# EAGLE design Mono_Audio_Amplifier_Scheffknecht_Melcher (EAGLE 9.6.2)
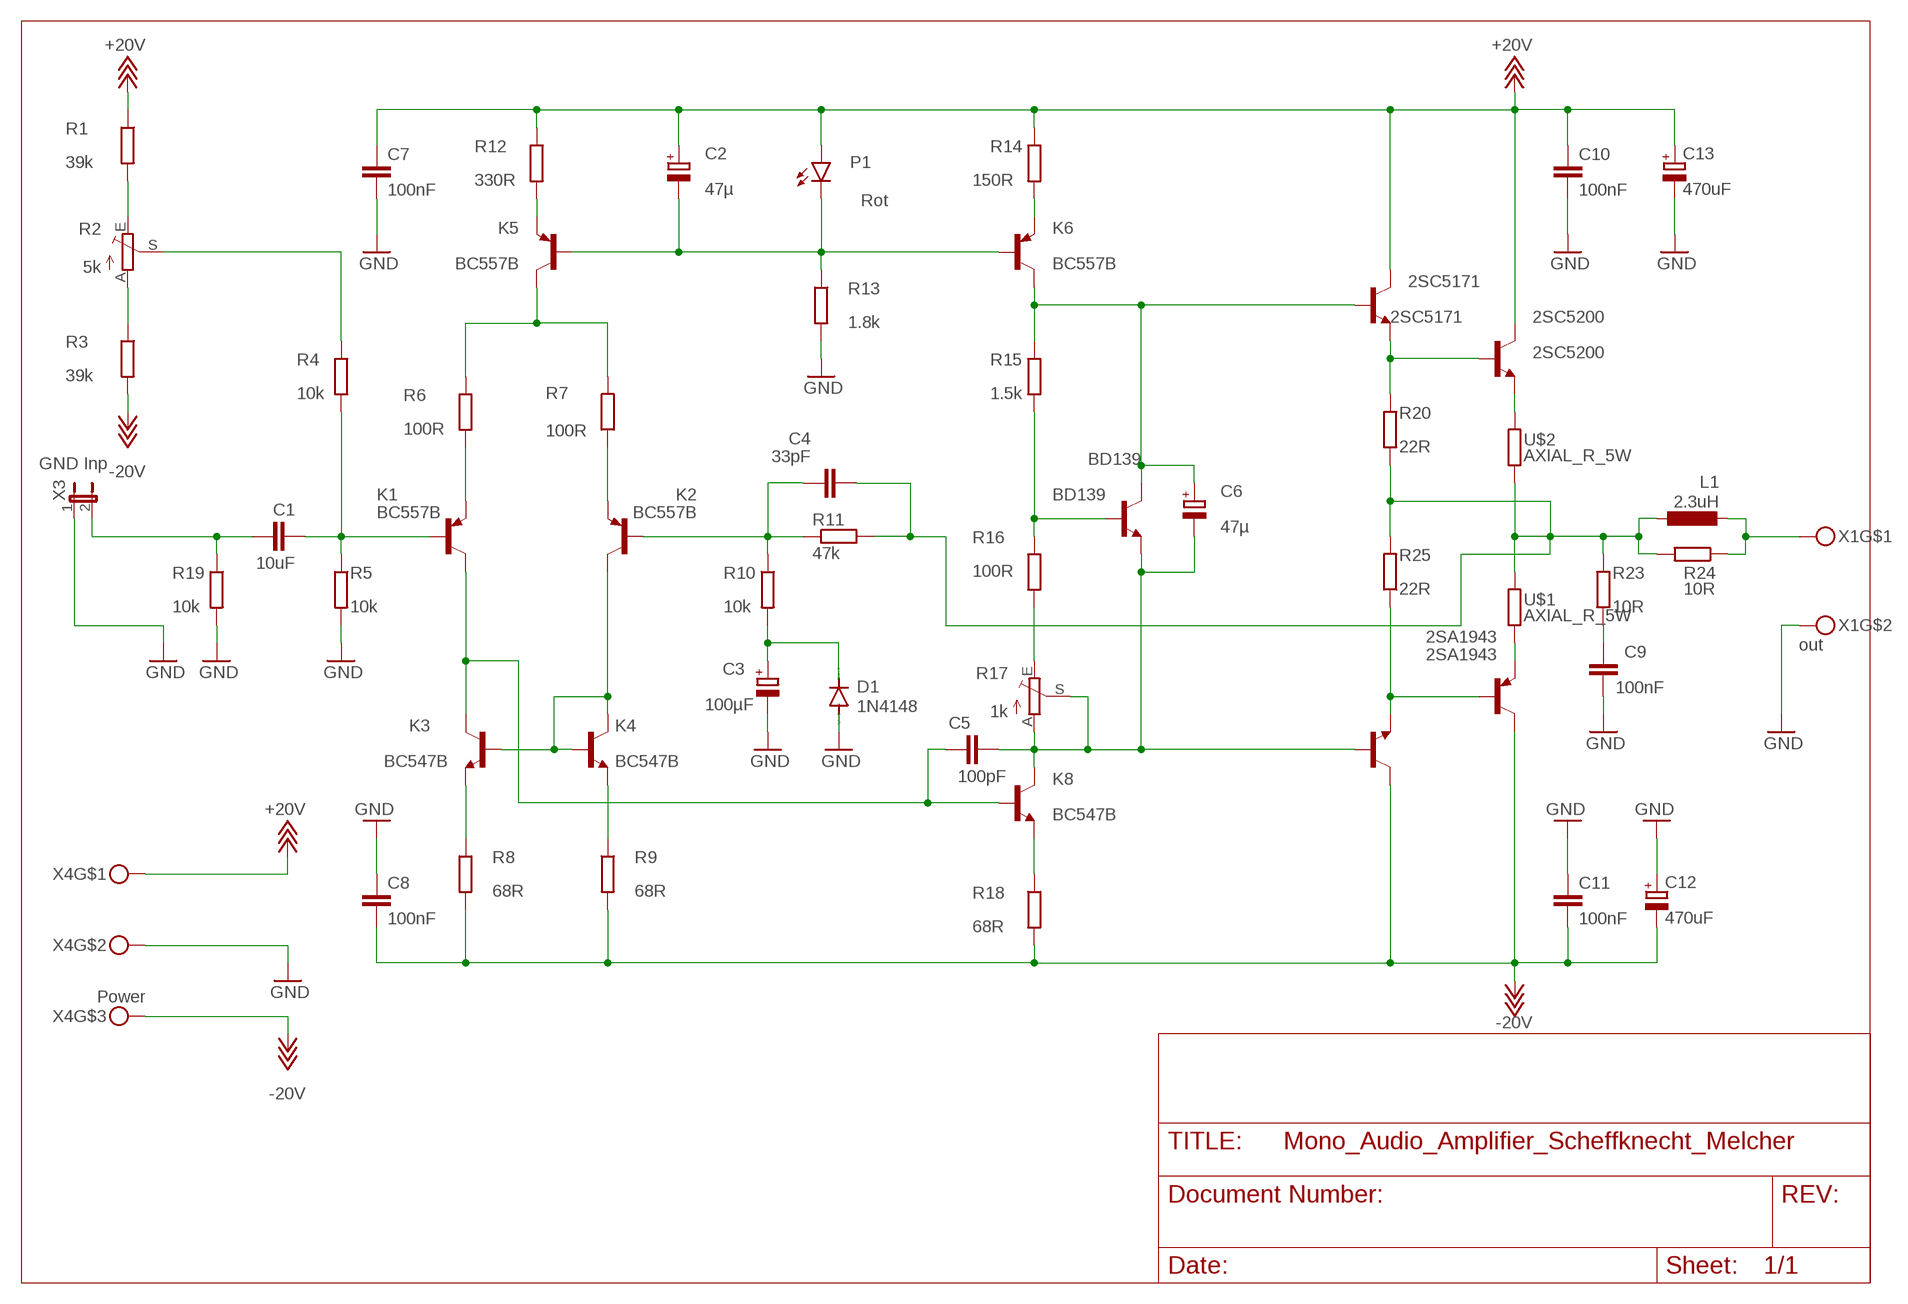
[diagram p0: schematic, sheet 1]

## Parts
2SA1930  2SA1930  2SC1306  [TO220BV]
2SA1943  2SA1943  PNP_TO264  [TO264]
2SC5171  2SC5171  2SC1306  [TO220BV]
2SC5200  2SC5200  NPN_TO264  [TO264]
BD139  BD139  -NPN-TO126V  [TO126V]
C1  10uF  C-EUC0805  [C0805]
C2  47µ  CPOL-EUE2.5-6  [E2,5-6]
C3  100µF  CPOL-EUE2.5-7  [E2,5-7]
C4  33pF  C-EUC0805  [C0805]
C5  100pF  C-EUC0805  [C0805]
C6  47µ  CPOL-EUE2.5-6  [E2,5-6]
C7  100nF  C-EUC0805  [C0805]
C8  100nF  C-EUC0805  [C0805]
C9  100nF  C-EUC0805  [C0805]
C10  100nF  C-EUC0805  [C0805]
C11  100nF  C-EUC0805  [C0805]
C12  470uF  CPOL-EUE3.5-8  [E3,5-8]
C13  470uF  CPOL-EUE3.5-8  [E3,5-8]
D1  1N4148  1N4148DO35-7  [DO35-7]
K1  BC557B  [TO92-EBC]
K2  BC557B  [TO92-EBC]
K3  BC547B  BC547-NPN-TO92-CBE  [TO92-CBE]
K4  BC547B  BC547-NPN-TO92-CBE  [TO92-CBE]
K5  BC557B  [TO92-EBC]
K6  BC557B  [TO92-EBC]
K8  BC547B  BC547-NPN-TO92-CBE  [TO92-CBE]
L1  2.3uH  L-EUTJ3-U2  [TJ3-U2]
P1  Rot  LED5MM  [LED5MM]
R1  39k  R-EU_R0805  [R0805]
R2  5k  TRIM_EU-S64W  [S64W]
R3  39k  R-EU_R0805  [R0805]
R4  10k  R-EU_R0805  [R0805]
R5  10k  R-EU_R0805  [R0805]
R6  100R  R-EU_R0805  [R0805]
R7  100R  R-EU_R0805  [R0805]
R8  68R  R-EU_R0805  [R0805]
R9  68R  R-EU_R0805  [R0805]
R10  10k  R-EU_R0805  [R0805]
R11  47k  R-EU_R0805  [R0805]
R12  330R  R-EU_R0805  [R0805]
R13  1.8k  R-EU_R0805  [R0805]
R14  150R  R-EU_R0805  [R0805]
R15  1.5k  R-EU_R0805  [R0805]
R16  100R  R-EU_R0805  [R0805]
R17  1k  TRIM_EU-S64W  [S64W]
R18  68R  R-EU_R0805  [R0805]
R19  10k  R-EU_R0805  [R0805]
R20  22R  R-EU_R0805  [R0805]
R23  10R  R-EU_R0805  [R0805]
R24  10R  R-EU_R0805  [R0805]
R25  22R  R-EU_R0805  [R0805]
U$1  AXIAL_R_5W  [AXIAL_RESISTOR]
U$2  AXIAL_R_5W  [AXIAL_RESISTOR]
X1  out  MKDS3/2_5,08  [MKDS3/2_5,08]
X3  GND Inp  JMP2  [JMP2]
X4  Power  MKDS3/3_5,08  [MKDS3/3_5,08]

## Nets
+18V: 2SC5171.2(C) 2SC5200.2(C) C2.+ C7.1 C10.1 C13.+ P1.A R1.1 R12.1 R14.1 X4.P$1 ; supply symbol labelled +20V
-18V: 2SA1930.2(C) 2SA1943.2(C) C8.2 C11.2 C12.- R3.2 R8.2 R9.2 R18.2 X4.P$3 ; supply symbol labelled -20V
AUX_IN: C1.2 K1.B R4.2 R5.1
GND: C3.- C7.2 C8.1 C9.1 C10.2 C11.1 C12.+ C13.- D1.A R5.2 R13.2 R19.2 X1.P$2 X3.1 X4.P$2
N$1: 2SC5200.3(E) U$2.P$2
N$2: 2SC5171.3(E) 2SC5200.1(B) R20.2
N$3: 2SA1943.3(E) U$1.P$1
N$5: C4.2 L1.1 R11.2 R20.1 R23.2 R24.2 R25.2 U$1.P$2 U$2.P$1
N$7: C5.1 K1.C K3.C K8.B
N$8: R16.2 R17.E
N$9: BD139.3(B) R15.2 R16.1
N$10: 2SA1930.1(B) BD139.1(E) C5.2 C6.- K8.C R17.A R17.S
N$11: 2SC5171.1(B) BD139.2(C) C6.+ K6.C R15.1
N$13: K8.E R18.1
N$14: K6.E R14.2
N$15: K5.C R6.1 R7.1
N$16: K5.E R12.2
N$17: C4.1 K2.B R10.1 R11.1
N$18: K4.E R9.1
N$19: C2.- K5.B K6.B P1.K(C) R13.1
N$20: K1.E R6.2
N$21: K3.E R8.1
N$22: K2.E R7.2
N$23: K2.C K3.B K4.B K4.C
N$24: C3.+ D1.C R10.2
N$25: C9.2 R23.1
N$26: C1.1 R19.1 X3.2
N$27: R1.2 R2.E
N$28: 2SA1930.3(E) 2SA1943.1(B) R25.1
N$29: R2.S R4.1
N$30: R2.A R3.1
N$31: L1.2 R24.1 X1.P$1

## Library data of the parts
2SA1930 2SC5171 = transistor:2SC1306: NPN Transistor Final RF Power Outupt Source: 2sc1306.pdf
2SA1943 = 0_Custom-Lib_Verstärker:PNP_TO264
2SC5200 = 0_Custom-Lib_Verstärker:NPN_TO264
BD139 K3 K4 K8 = transistor:*-NPN-: NPN Transistror BF959 corrected 2008.03.06
C1 C4 C5 C7-C11 = rcl:C-EU: CAPACITOR, European symbol; SPICEPREFIX: C
C2 C3 C6 C12 C13 = rcl:CPOL-EU: POLARIZED CAPACITOR, European symbol; SPICEPREFIX: C
D1 = diode:1N4148: DIODE high speed (Philips)
K1 K2 K5 K6 = transistor-pnp:BC557*: PNP Transistror
L1 = rcl:L-EU: INDUCTOR, European symbol; SPICEPREFIX: L
P1 = led:LED: LED OSRAM: - CHIPLED LG R971, LG N971, LY N971, LG Q971, LY Q971, LO R971, LY R971 LH N974, LH R974 LS Q976, LO Q976, LY Q976 LO Q996 - Hyper CHIPLED LW Q18S LB Q993, LB Q99A, LB R99A - SideLED LS A670, LO A670, LY A670, LG A670, LP A670 LB A673, LV A673, LT A673, LW A673 LH A674 LY A675 LS A676, LA A676, LO A676, LY A676, LW A676 LS A679, LY A679, LG A679 - Hyper Micro SIDELED® LS Y876, LA Y876, LO Y876, LY Y876 LT Y87S - SmartLED LW L88C, LW L88S LB L89C, LB L89S, LG L890 LS L89K, LO L89K, LY L89K LS L896, LA L896, LO L896, LY L896 - TOPLED LS T670, LO T670, LY T670, LG T670, LP T670 LSG T670, LSP T670, LSY T670, LOP T670, LYG T670 LG T671, LOG T671, LSG T671 LB T673, LV T673, LT T673, LW T673 LH T674 LS T676, LA T676, LO T676, LY T676, LB T676, LH T676, LSB T676, LW T676 LB T67C, LV T67C, LT T67C, LS T67K, LO T67K, LY T67K, LW E67C LS E67B, LA E67B, LO E67B, LY E67B, LB E67C, LV E67C, LT E67C LW T67C LS T679, LY T679, LG T679 LS T770, LO T770, LY T770, LG T770, LP T770 LB T773, LV T773, LT T773, LW T773 LH T774 LS E675, LA E675, LY E675, LS T675 LS T776, LA T776, LO T776, LY T776, LB T776 LHGB T686 LT T68C, LB T68C - Hyper Mini TOPLED® LB M676 - Mini TOPLED Santana® LG M470 LS M47K, LO M47K, LY M47K Source: http://www.osram.convergy.de LUXEON: - LUMILED® LXK2-PW12-R00, LXK2-PW12-S00, LXK2-PW14-U00, LXK2-PW14-V00 LXK2-PM12-R00, LXK2-PM12-S00, LXK2-PM14-U00 LXK2-PE12-Q00, LXK2-PE12-R00, LXK2-PE12-S00, LXK2-PE14-T00, LXK2-PE14-U00 LXK2-PB12-K00, LXK2-PB12-L00, LXK2-PB12-M00, LXK2-PB14-N00, LXK2-PB14-P00, LXK2-PB14-Q00 LXK2-PR12-L00, LXK2-PR12-M00, LXK2-PR14-Q00, LXK2-PR14-R00 LXK2-PD12-Q00, LXK2-PD12-R00, LXK2-PD12-S00 LXK2-PH12-R00, LXK2-PH12-S00 LXK2-PL12-P00, LXK2-PL12-Q00, LXK2-PL12-R00 Source: www.luxeon.com KINGBRIGHT: KA-3528ASYC Source: www.kingbright.com
R1 R3-R16 R18-R20 R23-R25 = rcl:R-EU_: RESISTOR, European symbol; SPICEPREFIX: R
R2 R17 = pot:TRIM_EU-: POTENTIOMETER
U$1 U$2 = 0_Custom-Lib_Verstärker:AXIAL_R_5W
X1 = 0_HTL_elektro:MKDS3/2_5,08: Leiterplattenklemme 2-polig
X3 = 0_HTL_elektro:JMP2: Jumper 2-polig
X4 = 0_HTL_elektro:MKDS3/3_5,08: Leiterplattenklemme 3-polig

## Module TEST
Ports: 

### Library data of the parts

## Board
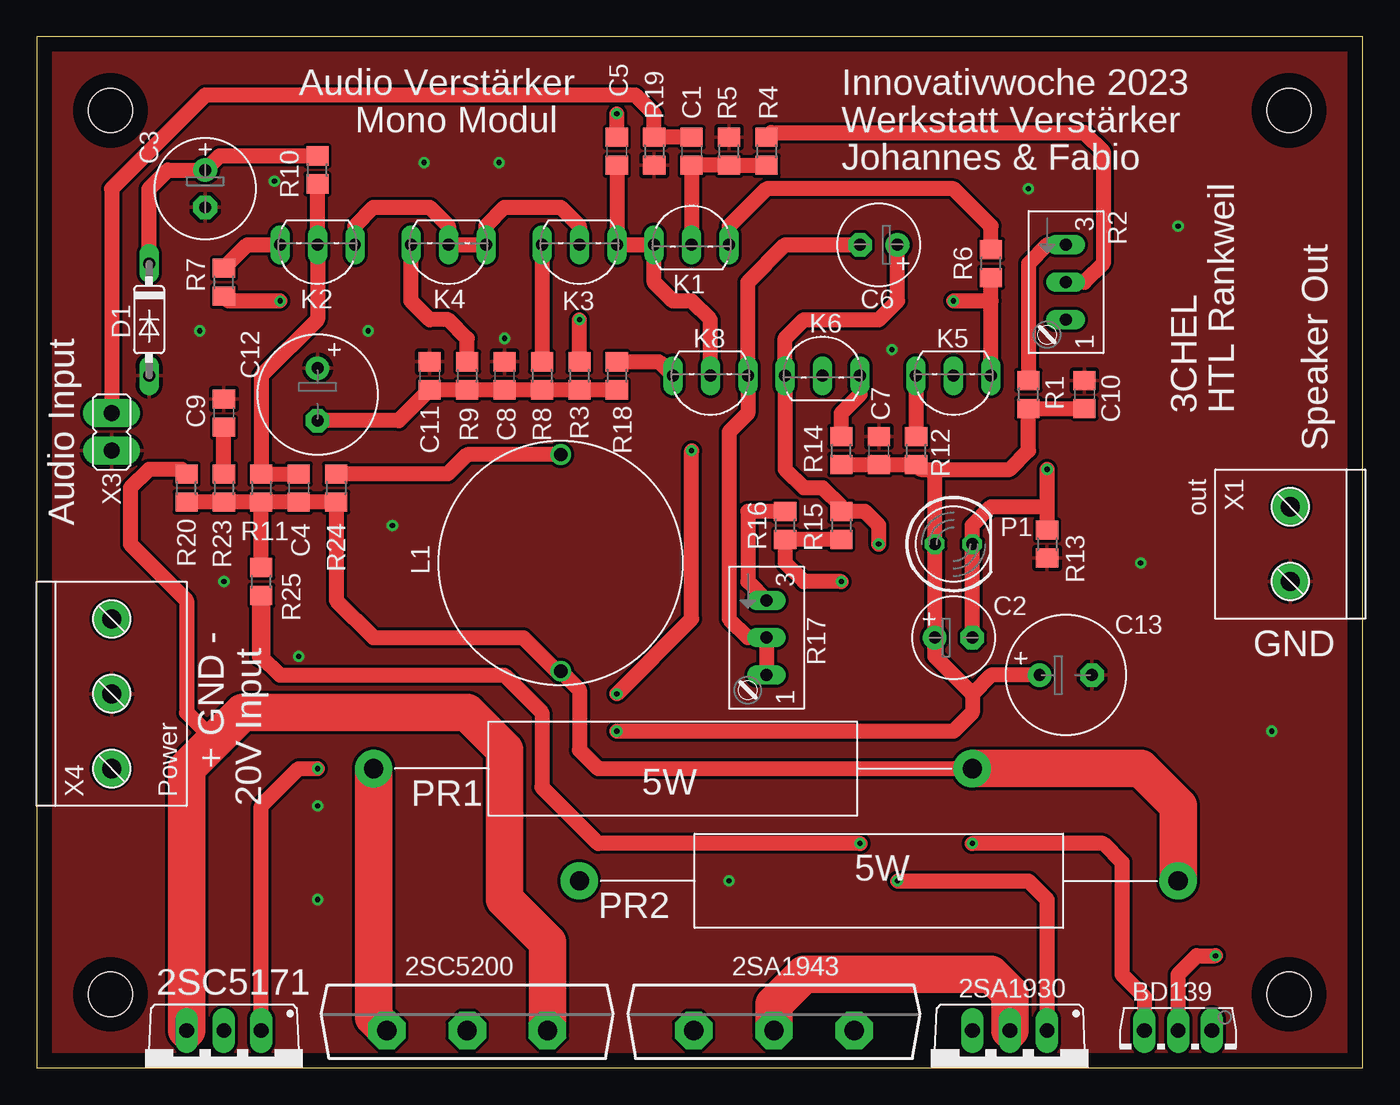
[diagram p1: board, top side]
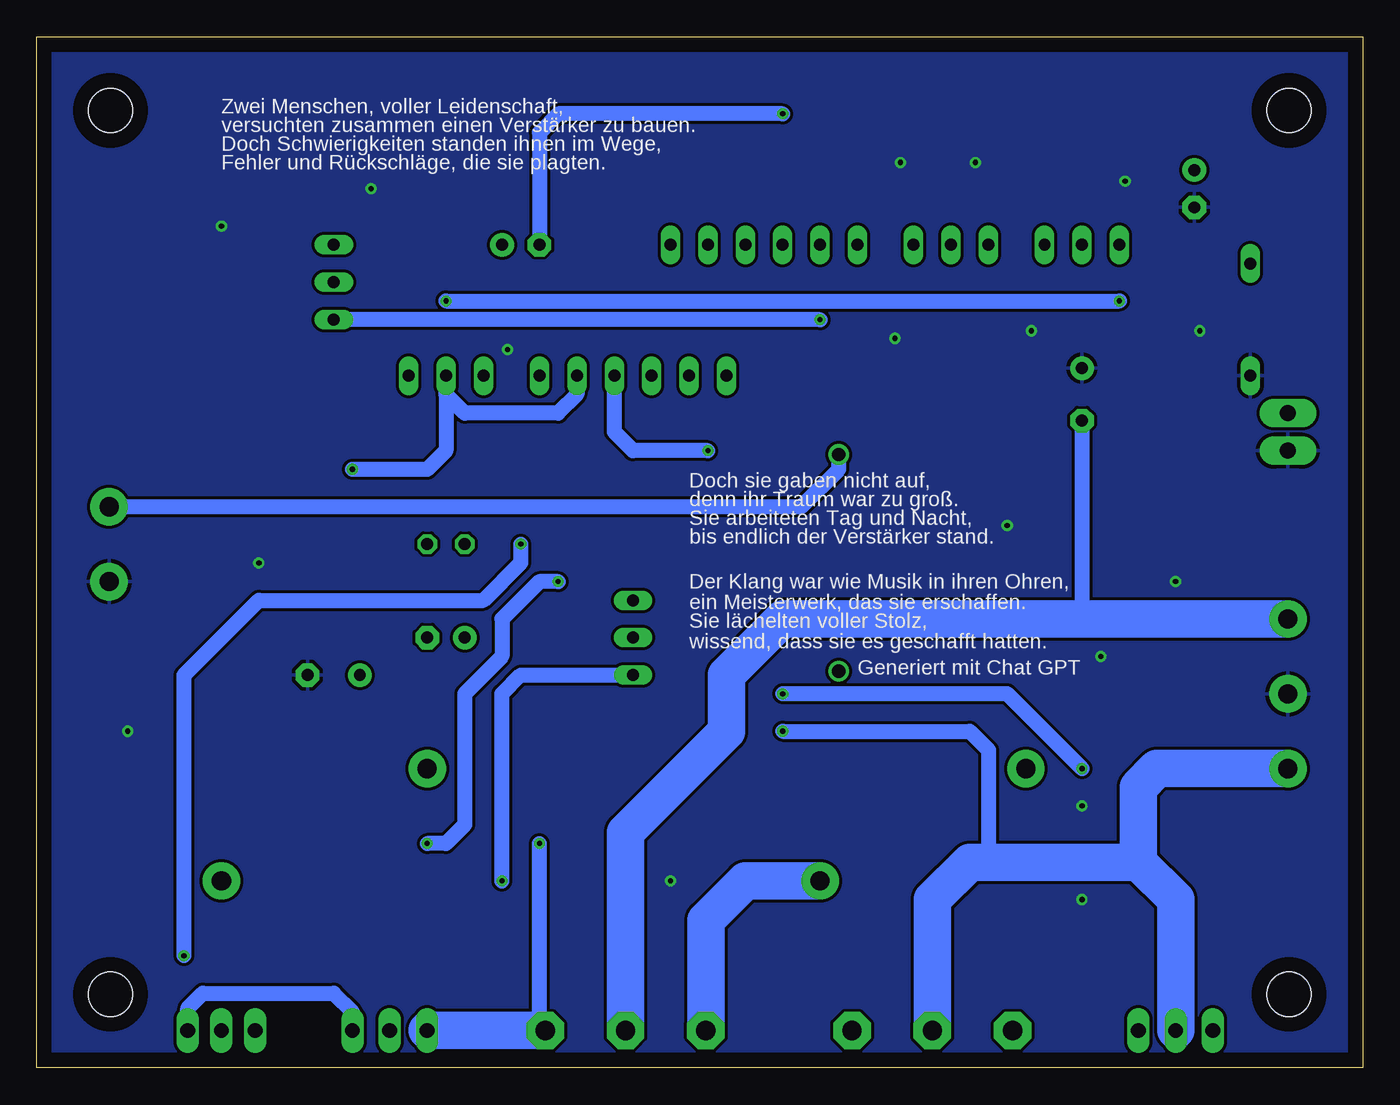
[diagram p2: board, bottom side, seen from below]

Size 90 x 70 mm. Coordinates in mm from the lower left corner, seen from the top.
Outline: 0,0 90,0 90,70 0,70 0,0
Copper layers (1*16): Top 0.035mm / dielectric 1.5mm / Bottom 0.035mm
Design rules "default *": minimum track width 16mil, minimum drill 0.35mm, track to track 8mil, track to pad 8mil, pad to pad 8mil, via to via 8mil, smd to smd 8mil, copper to edge 40mil, drill to drill 8mil, minimum pad ring 10mil, minimum via ring 8mil, stop-mask expansion 4mil, vias tented up to drill 0mil, thermal gap 10mil
Holes 3 mm at 5,65 85,65 85,5 5,5

### Footprints (pad centres in the part's own frame; a part is rotated, then mirrored left to right if it is on the bottom)
TO220BV = drill 1.016 long: 1 -2.54,-2.54; 2 0,-2.54; 3 2.54,-2.54
TO264 = drill 1.3 pad 2.54 octagon: 1 -5.45,0; 2 0,0; 3 5.45,0
TO126V = drill 1.016 long: 1 -2.286,-1.27; 2 0,-1.27; 3 2.286,-1.27
C0805 = smd 1.3 x 1.5: 1 -0.95,0; 2 0.95,0
E2,5-6 = drill 0.813 pad 1.6: + -1.27,0 | drill 0.813 pad 1.6 octagon: - 1.27,0
E2,5-7 = drill 0.813 pad 1.6: + -1.27,0 | drill 0.813 pad 1.6 octagon: - 1.27,0
E3,5-8 = drill 0.813 pad 1.6: + -1.778,0 | drill 0.813 pad 1.6 octagon: - 1.778,0
DO35-7 = drill 0.813 long: A 3.81,0; C -3.81,0
TO92-EBC = drill 0.813 long: B 0,-1.27; C -2.54,-1.27; E 2.54,-1.27
TO92-CBE = drill 0.813 long: B 0,0; C -2.54,0; E 2.54,0
TJ3-U2 = drill 0.9: 1 -7.35,0; 2 7.35,0
LED5MM = drill 0.813 octagon: A -1.27,0; K 1.27,0
R0805 = smd 1.3 x 1.5: 1 -0.95,0; 2 0.95,0
S64W = drill 0.813 long: A 2.54,1.27; E -2.54,1.27; S 0,1.27
AXIAL_RESISTOR = drill 1.3 pad 2.54: P$1 -20.32,0; P$2 20.32,0
MKDS3/2_5,08 = drill 1.3 pad 2.54: P$1 -2.54,0; P$2 2.54,0
JMP2 = drill 1.1 pad 1.93 long: 1 0,-1.27; 2 0,1.27
MKDS3/3_5,08 = drill 1.3 pad 2.54: P$1 -5.08,0; P$2 0,0; P$3 5.08,0

### Placement (x,y rotation side)
2SA1930  66.04,0 180 top
2SA1943  50.04,2.54 180 top
2SC5171  12.7,0 180 top
2SC5200  29.21,2.54 180 top
BD139  77.47,1.27 180 top
C1  44.45,62.23 270 top
C2  62.23,29.21 0 top
C3  11.43,59.69 270 top
C4  17.78,39.37 270 top
C5  39.37,62.23 90 top
C6  57.15,55.88 180 top
C7  57.15,41.91 90 top
C8  31.75,46.99 270 top
C9  12.7,44.45 270 top
C10  71.12,45.72 90 top
C11  26.67,46.99 270 top
C12  19.05,45.72 270 top
C13  69.85,26.67 0 top
D1  7.62,50.8 270 top
K1  44.45,57.15 0 top
K2  19.05,54.61 180 top
K3  36.83,55.88 180 top
K4  27.94,55.88 180 top
K5  62.23,45.72 180 top
K6  53.34,48.26 0 top
K8  45.72,46.99 180 top
L1  35.56,34.29 90 top
P1  62.23,35.56 0 top
R1  67.31,45.72 90 top
R2  68.58,53.34 270 top
R3  36.83,46.99 270 top
R4  49.53,62.23 270 top
R5  46.99,62.23 90 top
R6  64.77,54.61 90 top
R7  12.7,53.34 90 top
R8  34.29,46.99 270 top
R9  29.21,46.99 270 top
R10  19.05,60.96 90 top
R11  15.24,39.37 270 top
R12  59.69,41.91 90 top
R13  68.58,35.56 270 top
R14  54.61,41.91 90 top
R15  54.61,36.83 270 top
R16  50.8,36.83 90 top
R17  48.26,29.21 270 top
R18  39.37,46.99 270 top
R19  41.91,62.23 270 top
R20  10.16,39.37 90 top
R23  12.7,39.37 270 top
R24  20.32,39.37 270 top
R25  15.24,33.02 90 top
U$1  57.15,12.7 0 top
U$2  43.18,20.32 180 top
X1  85.09,35.56 270 top
X3  5.08,43.18 0 top
X4  5.08,25.4 90 top

### Tracks (layer width: path | path; a pad name or v marks a point on that pad's centre or on a via)
+18V  (via drill 0.35)
  Top 1.016: C10.1 R1.1 67.31,41.91 66.04,40.64 60.96,40.64 | 63.5,25.4 63.5,24.13 62.23,22.86 v39.37,22.86 | 63.5,25.4 60.96,27.94 C2.+ P1.A 60.96,40.64 | 63.5,25.4 64.77,26.67 C13.+ | 60.96,40.64 60.01,40.64 R12.1 C7.1 R14.1
  Bottom 1.016: v39.37,22.86 26.67,22.86 25.4,21.59 25.4,13.97
  Bottom 2.54: 15.24,13.97 25.4,13.97 26.67,13.97 29.21,11.43 2SC5200.2 | X4.P$1 13.97,20.32 15.24,19.05 15.24,13.97 | 15.24,13.97 12.7,11.43 2SC5171.2
-18V
  Top 1.016: C12.- 24.57,43.94 C11.2 R9.2 C8.2 R8.2 R3.2 R18.2
  Top 2.54: 2SA1930.2 66.04,5.08 64.77,6.35 52.07,6.35 50.04,4.32 2SA1943.2
  Bottom 1.016: C12.- 19.05,30.48
  Bottom 2.54: X4.P$3 19.05,30.48 39.37,30.48 43.18,26.67 43.18,22.86 50.04,16 2SA1943.2
AUX_IN
  Top 1.016: K1.B C1.2 R5.1 R4.2
GND  (via drill 0.35)
  other vias: 31.75,49.53 24.13,36.83 31.37,61.47 77.47,57.15 83.82,22.86 19.05,17.78 19.05,11.43 11.05,50.04 22.48,50.04 58.04,48.77 16.13,60.2 26.29,61.47 67.31,59.69 74.93,34.29 46.99,12.7 17.78,27.94 12.7,33.02
  pour Top: 0,0 0,70 90,70 90,0
  pour Bottom: 0,0 0,70 90,70 90,0
N$1
  Top 2.54: U$2.P$2 22.86,3.44 2SC5200.3
N$2
  Top 1.016: R20.2 9.84,40.64 7.62,40.64 6.35,39.37 6.35,35.56 10.16,31.75 10.16,24.13 12.06,22.23
  Top 2.54: 2SC5171.3 10.16,20.32 12.06,22.23 13.97,24.13 29.21,24.13 31.75,21.59 31.75,11.43 34.66,8.52 2SC5200.1
N$3
  Bottom 2.54: U$1.P$1 41.91,12.7 44.59,10.02 2SA1943.3
N$5
  Top 1.016: R25.2 R11.2 | R11.2 C4.2 R24.2 20.32,31.75 22.86,29.21 33.02,29.21 35.29,26.94 L1.1 36.83,25.67 36.83,21.59 38.1,20.32 U$2.P$1 | R11.2 R23.2 R20.1
  Top 2.54: U$2.P$1 74.93,20.32 77.47,17.78 U$1.P$2
N$7
  Top 1.016: K8.B 45.72,50.8 44.45,52.07 43.18,52.07 41.91,53.34 K1.C K3.C C5.1
N$8
  Top 1.016: R16.2 48.26,37.78 48.26,33.02 R17.E
N$9  (via drill 0.35)
  Top 1.016: v54.61,33.02 52.07,33.02 50.8,34.29 R16.1 R15.2 | v63.5,15.24 72.39,15.24 73.66,13.97 73.66,6.35 75.18,4.83 BD139.3
  Bottom 1.016: v54.61,33.02 55.88,33.02 58.42,30.48 58.42,27.94 60.96,25.4 60.96,16.51 62.23,15.24 v63.5,15.24
N$10  (via drill 0.35)
  Top 1.016: R17.A R17.S 48.26,29.21 46.99,30.48 46.99,43.18 48.26,44.45 K8.C 48.26,53.34 50.8,55.88 C6.- | C5.2 v39.37,64.77 | v58.42,12.7 67.31,12.7 68.58,11.43 2SA1930.1
  Bottom 1.016: C6.- 55.88,63.5 54.61,64.77 v39.37,64.77 | R17.A 57.15,26.67 58.42,25.4 v58.42,12.7 | BD139.1 79.76,4.06 78.74,5.08 69.85,5.08 68.58,3.81 2SA1930.1
N$11  (via drill 0.35)
  Top 1.016: C6.+ 58.42,52.07 57.15,50.8 52.07,50.8 50.8,49.53 K6.C 50.8,40.64 52.07,39.37 53.34,39.37 54.61,38.1 R15.1 56.2,37.78 57.15,36.83 v57.15,35.56 | 2SC5171.1 15.24,17.78 17.78,20.32 v19.05,20.32 | v39.37,25.4 44.45,30.48 v44.45,41.91 | v80.01,7.62 78.74,7.62 77.47,6.35 BD139.2
  Bottom 1.016: v57.15,35.56 57.15,34.29 59.69,31.75 74.93,31.75 80.01,26.67 v80.01,7.62 | v19.05,20.32 24.13,25.4 v39.37,25.4 | v44.45,41.91 49.53,41.91 50.8,43.18 K6.C
N$13
  Top 1.016: R18.1 42.23,47.94 K8.E
N$14
  Top 1.016: R14.2 54.61,44.45 55.88,45.72 K6.E
N$15  (via drill 0.35)
  Top 1.016: K5.C 64.77,52.07 | 64.77,52.07 R6.1 | 64.77,52.07 v62.23,52.07 | v16.51,52.07 13.02,52.07 R7.1
  Bottom 1.016: v62.23,52.07 v16.51,52.07
N$16
  Top 1.016: K5.E R12.2
N$17
  Top 1.016: C4.1 R11.1 15.24,46.99 19.05,50.8 K2.B R10.1
N$18
  Top 1.016: R9.1 29.21,49.53 27.94,50.8 26.67,50.8 25.4,52.07 K4.E
N$19  (via drill 0.35)
  Top 1.016: C2.- P1.K 63.5,36.83 64.77,38.1 68.58,38.1 | v68.58,40.64 68.58,38.1 | 68.58,38.1 R13.1
  Bottom 1.016: K6.B 53.34,45.72 54.61,44.45 60.96,44.45 62.23,45.72 K5.B 62.23,41.91 63.5,40.64 v68.58,40.64
N$20
  Top 1.016: R6.2 64.77,57.15 62.23,59.69 49.53,59.69 46.99,57.15 K1.E
N$21
  Top 1.016: K3.E R8.1
N$22
  Top 1.016: R7.2 14.29,55.88 K2.E
N$23
  Top 1.016: K3.B 36.83,57.15 35.56,58.42 31.75,58.42 30.48,57.15 K4.C K4.B 27.94,57.15 26.67,58.42 22.86,58.42 21.59,57.15 K2.C
N$24
  Top 1.016: R10.2 12.38,61.91 C3.+ 8.89,60.96 7.62,59.69 D1.C
N$25
  Top 1.016: R23.1 C9.2
N$26
  Top 1.016: C1.1 R19.1 41.91,64.77 40.64,66.04 11.43,66.04 5.08,59.69 X3.2
N$27
  Top 1.016: R2.E 68.58,55.88 67.31,54.61 R1.2
N$28  (via drill 0.35)
  Top 1.016: 15.24,27.94 16.51,26.67 31.75,26.67 34.29,24.13 34.29,19.05 38.1,15.24 v55.88,15.24
  Top 1.27: R25.1 15.24,27.94
  Bottom 1.016: 2SA1943.1 55.88,2.93 v55.88,15.24
  Bottom 2.54: 2SA1943.1 2SA1930.3
N$29
  Top 1.016: R4.1 49.85,63.5 71.12,63.5 72.39,62.23 72.39,54.61 71.12,53.34 R2.S
N$30  (via drill 0.35)
  Top 1.016: R3.1 v36.83,50.8
  Bottom 1.016: v36.83,50.8 R2.A
N$31
  Top 1.016: L1.2 29.21,41.64 27.89,40.32 R24.1
  Bottom 1.016: X1.P$1 38.1,38.1 35.56,40.64 L1.2

### Text on the board
tNames: Audio Verstärker | Innovativwoche 2023 | Mono Modul | Werkstatt Verstärker | Johannes & Fabio | 3CHEL | HTL Rankweil | Speaker Out | Audio Input | GND | + GND - | 20V Input | PR1 | PR2
bNames: Zwei Menschen, voller Leidenschaft, | versuchten zusammen einen Verstärker zu bauen. | Doch Schwierigkeiten standen ihnen im Wege, | Fehler und Rückschläge, die sie plagten. | Doch sie gaben nicht auf, | denn ihr Traum war zu groß. | Sie arbeiteten Tag und Nacht, | bis endlich der Verstärker stand. | Der Klang war wie Musik in ihren Ohren, | ein Meisterwerk, das sie erschaffen. | Sie lächelten voller Stolz, | wissend, dass sie es geschafft hatten. | Generiert mit Chat GPT